# EAGLE design imu (EAGLE 9.5.2)
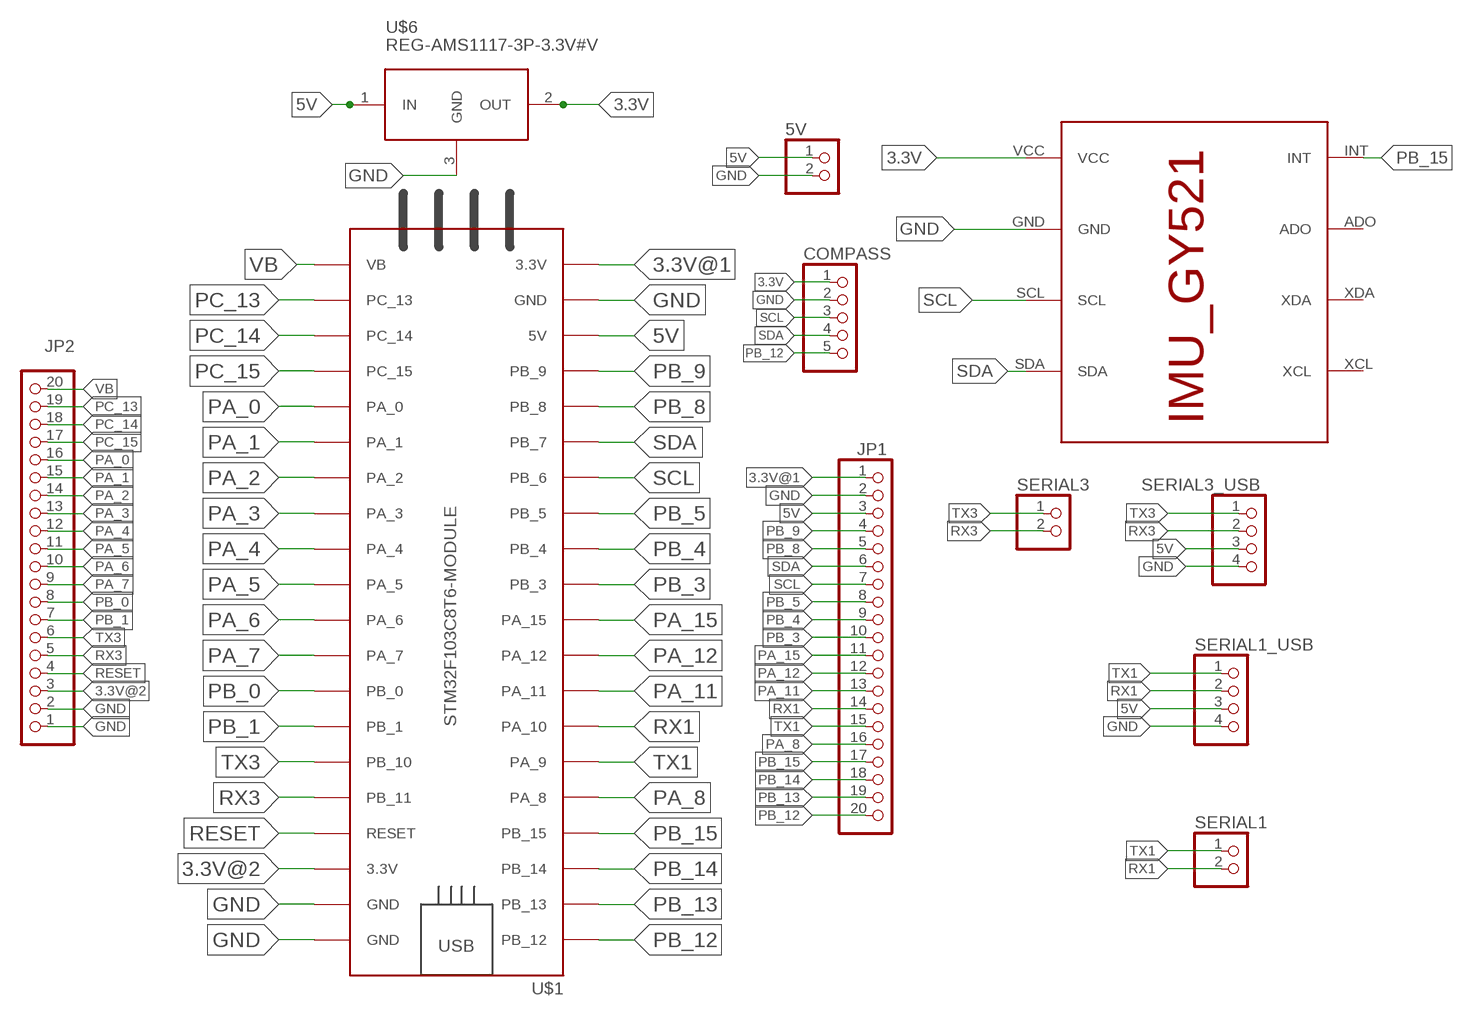
[diagram p0: schematic, sheet 1]

## Parts
5V  PINHD-2_DATA  [1X02_DATA]
COMPASS  PINHD-1X5  [1X05]
JP1  PINHD-1X20  [1X20]
JP2  PINHD-1X20  [1X20]
SERIAL1  PINHD-2_DATA  [1X02_DATA]
SERIAL1_USB  PINHD-4_DATA  [1X04_DATA]
SERIAL3  PINHD-2_DATA  [1X02_DATA]
SERIAL3_USB  PINHD-4_DATA  [1X04_DATA]
U$1  STM32F103C8T6-MODULE  [STM32F103C8T6-MODULE]
U$2  IMU_ROBOCON_GY521  [IMU_GY521]
U$6  REG-AMS1117-3P-3.3V#V  [REG-AMS1117-3P#V]

## Nets
3.3V: COMPASS.1 U$2.VCC U$6.2(OUT)
3.3V@1: JP1.1 U$1.3.3V_1(3.3V)
3.3V@2: JP2.3 U$1.3.3V_2(3.3V)
5V: 5V.1 JP1.3 SERIAL1_USB.3 SERIAL3_USB.3 U$1.5V U$6.1(IN)
GND: 5V.2 COMPASS.2 JP1.2 JP2.1 JP2.2 SERIAL1_USB.4 SERIAL3_USB.4 U$1.GND_1(GND) U$1.GND_2(GND) U$1.GND_3(GND) U$2.GND U$6.3(GND)
PA_0: JP2.16 U$1.PA_0
PA_1: JP2.15 U$1.PA_1
PA_2: JP2.14 U$1.PA_2
PA_3: JP2.13 U$1.PA_3
PA_4: JP2.12 U$1.PA_4
PA_5: JP2.11 U$1.PA_5
PA_6: JP2.10 U$1.PA_6
PA_7: JP2.9 U$1.PA_7
PA_8: JP1.16 U$1.PA_8
PA_11: JP1.13 U$1.PA_11
PA_12: JP1.12 U$1.PA_12
PA_15: JP1.11 U$1.PA_15
PB_0: JP2.8 U$1.PB_0
PB_1: JP2.7 U$1.PB_1
PB_3: JP1.10 U$1.PB_3
PB_4: JP1.9 U$1.PB_4
PB_5: JP1.8 U$1.PB_5
PB_8: JP1.5 U$1.PB_8
PB_9: JP1.4 U$1.PB_9
PB_12: COMPASS.5 JP1.20 U$1.PB_12
PB_13: JP1.19 U$1.PB_13
PB_14: JP1.18 U$1.PB_14
PB_15: JP1.17 U$1.PB_15 U$2.INT
PC_13: JP2.19 U$1.PC_13
PC_14: JP2.18 U$1.PC_14
PC_15: JP2.17 U$1.PC_15
RESET: JP2.4 U$1.RESET
RX1: JP1.14 SERIAL1.2 SERIAL1_USB.2 U$1.PA_10
RX3: JP2.5 SERIAL3.2 SERIAL3_USB.2 U$1.PB_11
SCL: COMPASS.3 JP1.7 U$1.PB_6 U$2.SCL
SDA: COMPASS.4 JP1.6 U$1.PB_7 U$2.SDA
TX1: JP1.15 SERIAL1.1 SERIAL1_USB.1 U$1.PA_9
TX3: JP2.6 SERIAL3.1 SERIAL3_USB.1 U$1.PB_10
VB: JP2.20 U$1.VB
Unconnected: U$2.ADO U$2.XCL U$2.XDA

## Library data of the parts
5V SERIAL1 SERIAL3 = MIA_LIBRARY-2-2-2:PINHD-2_DATA: PIN HEADER
COMPASS = MIA_LIBRARY-2-2-2:PINHD-1X5: PIN HEADER
JP1 JP2 = MIA_LIBRARY-2-2-2:PINHD-1X20: PIN HEADER
SERIAL1_USB SERIAL3_USB = MIA_LIBRARY-2-2-2:PINHD-4_DATA: PIN HEADER
U$1 = MIA_LIBRARY-2-2-2:STM32F103C8T6-MODULE: STM32F103C8T6 module with ARM Cortex-3, 20kB SRAM, 64kB Flash, 72MHz
U$2 = MIA_LIBRARY-2-2-2:IMU_ROBOCON_GY521
U$6 = MIA_LIBRARY-2-2-2:REG-AMS1117-3P-*: Linear Regulator based on AMS1117 chip 3-pin version AMS1117 datasheet is available here: http://www.advanced-monolithic.com/pdf/ds1117.pdf Click here to find device on ebay.com <http://www.ebay.com/sch/ams1117+module> Note: There are many variants. Search for the proper version.

## Board
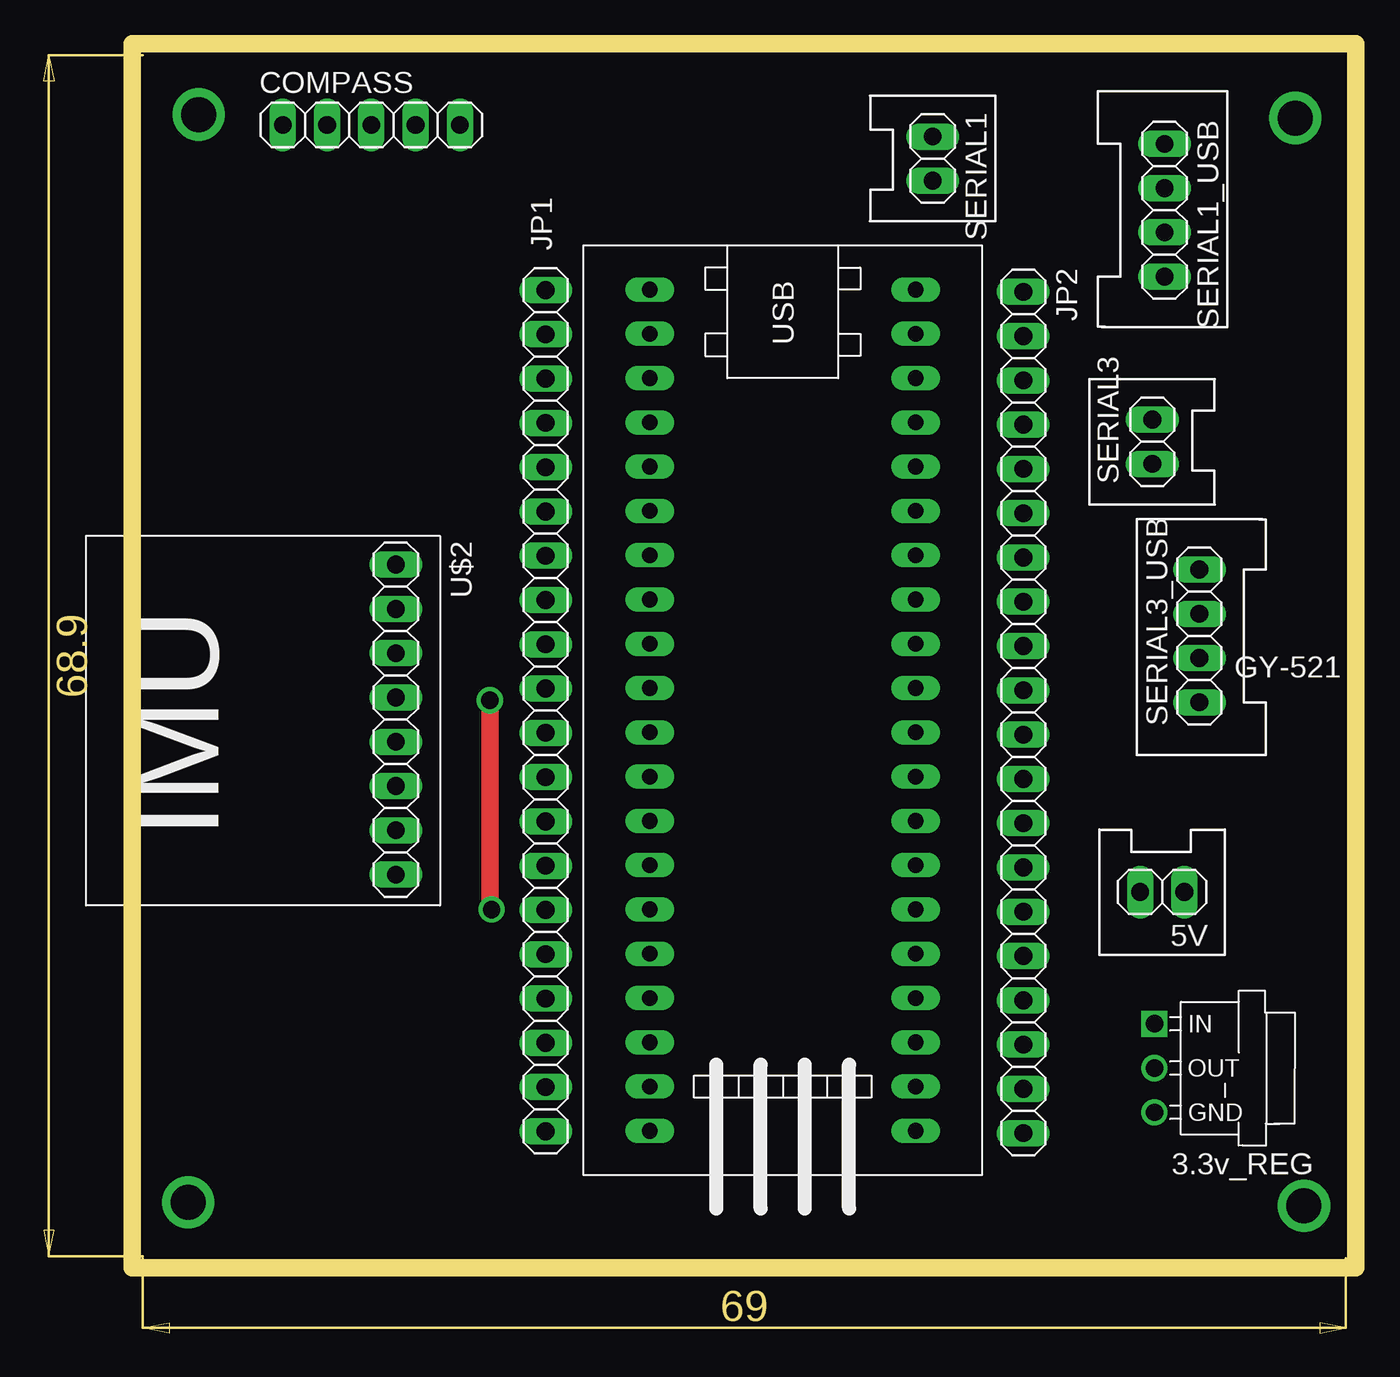
[diagram p1: board, top side]
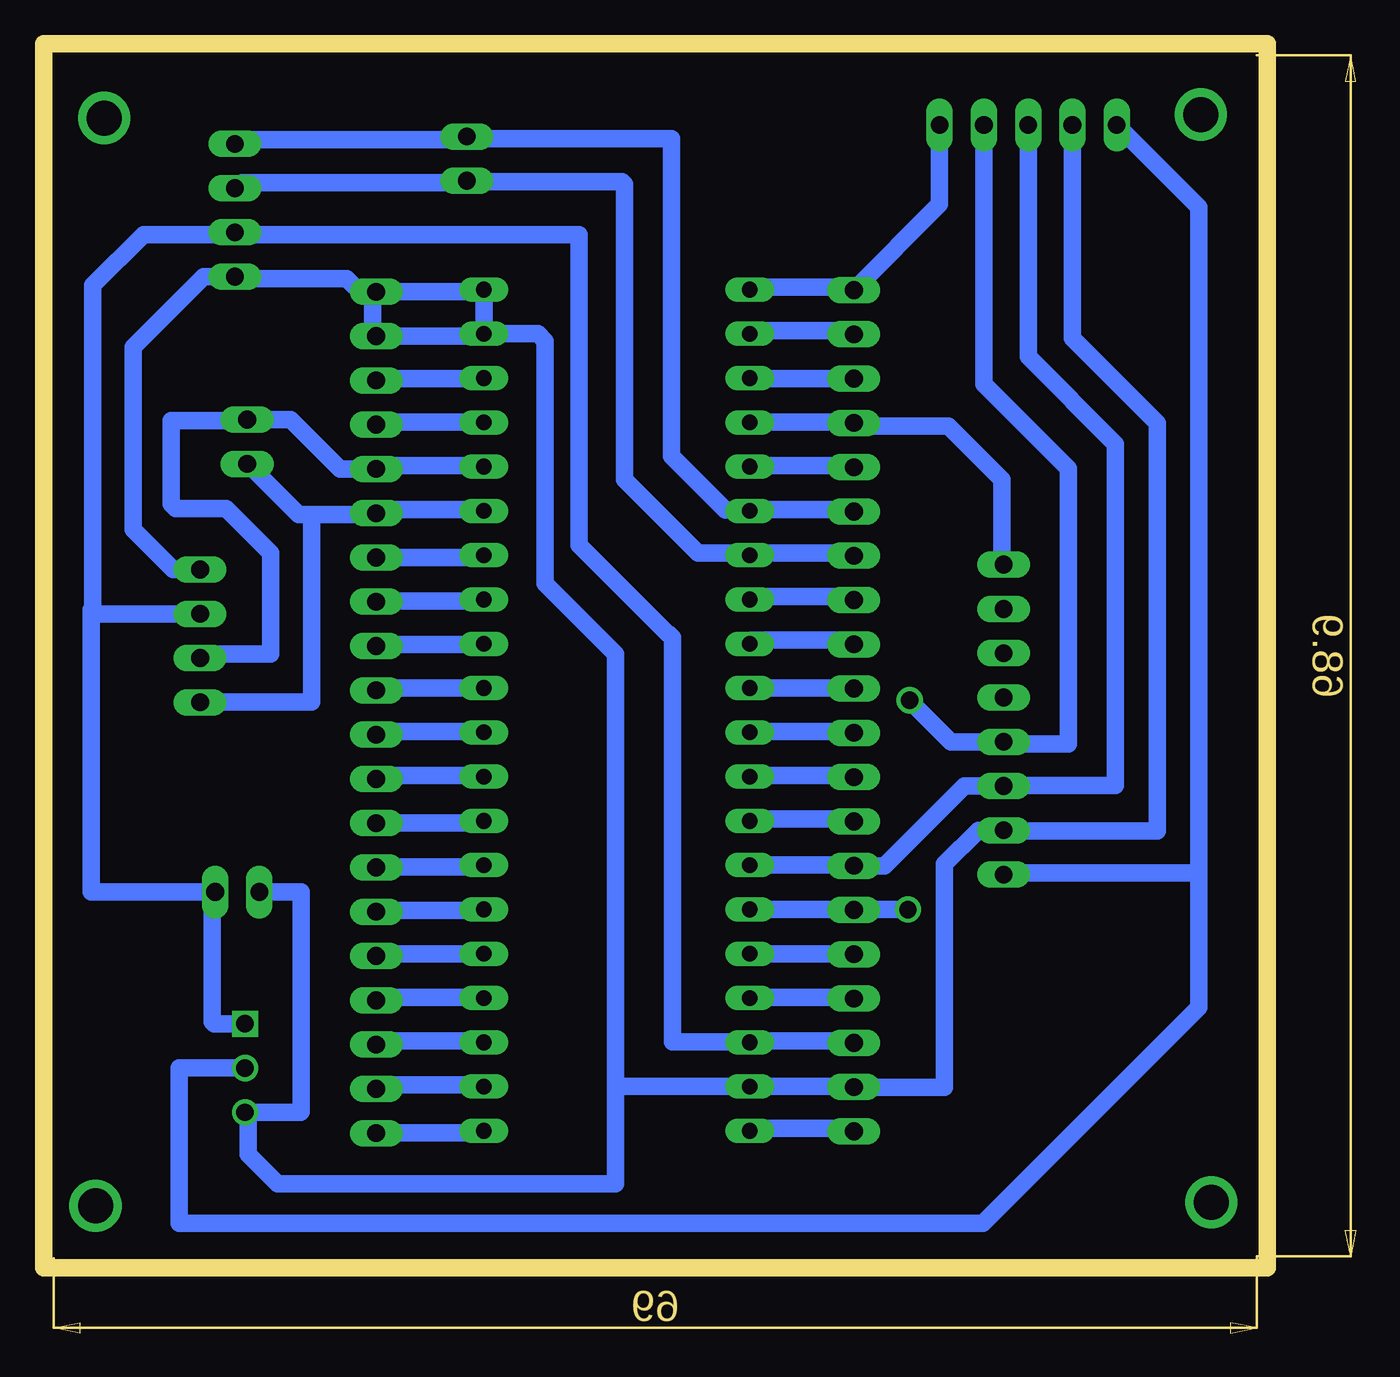
[diagram p2: board, bottom side, seen from below]

Size 70.2 x 70.21 mm. Coordinates in mm from the lower left corner, seen from the top.
Outline: 0.01,0 70.2,0 70.2,70.21 0,70.21 0.01,0
Copper layers (1*16): Top 0.035mm / dielectric 1.5mm / Bottom 0.035mm
Design rules "default *": minimum track width 1mm, minimum drill 0.35mm, track to track 0.8mm, track to pad 0.8mm, pad to pad 0.8mm, via to via 0.8mm, smd to smd 6mil, copper to edge 0.8mm, drill to drill 0.8mm, minimum pad ring 10mil, minimum via ring 8mil, stop-mask expansion 4mil, vias tented up to drill 0mil, thermal gap 10mil

### Footprints (pad centres in the part's own frame; a part is rotated, then mirrored left to right if it is on the bottom)
1X02_DATA = drill 1.016 long: 1 -1.27,0; 2 1.27,0
1X05 = drill 1.016 long: 1 -5.08,0; 2 -2.54,0; 3 0,0; 4 2.54,0; 5 5.08,0
1X20 = drill 1.016 long: 1 -24.13,0; 2 -21.59,0; 3 -19.05,0; 4 -16.51,0; 5 -13.97,0; 6 -11.43,0; 7 -8.89,0; 8 -6.35,0; 9 -3.81,0; 10 -1.27,0; 11 1.27,0; 12 3.81,0; 13 6.35,0; 14 8.89,0; 15 11.43,0; 16 13.97,0; 17 16.51,0; 18 19.05,0; 19 21.59,0; 20 24.13,0
1X04_DATA = drill 1.016 long: 1 -3.81,0; 2 -1.27,0; 3 1.27,0; 4 3.81,0
STM32F103C8T6-MODULE = drill 0.9 long: 3.3V_1 25.4,-7.62; 3.3V_2 -17.78,7.62; 5V 20.32,-7.62; GND_1 22.86,-7.62; GND_2 -20.32,7.62; GND_3 -22.86,7.62; PA_0 15.24,7.62; PA_1 12.7,7.62; PA_2 10.16,7.62; PA_3 7.62,7.62; PA_4 5.08,7.62; PA_5 2.54,7.62; PA_6 0,7.62; PA_7 -2.54,7.62; PA_8 -12.7,-7.62; PA_9 -10.16,-7.62; PA_10 -7.62,-7.62; PA_11 -5.08,-7.62; PA_12 -2.54,-7.62; PA_15 0,-7.62; PB_0 -5.08,7.62; PB_1 -7.62,7.62; PB_3 2.54,-7.62; PB_4 5.08,-7.62; PB_5 7.62,-7.62; PB_6 10.16,-7.62; PB_7 12.7,-7.62; PB_8 15.24,-7.62; PB_9 17.78,-7.62; PB_10 -10.16,7.62; PB_11 -12.7,7.62; PB_12 -22.86,-7.62; PB_13 -20.32,-7.62; PB_14 -17.78,-7.62; PB_15 -15.24,-7.62; PC_13 22.86,7.62; PC_14 20.32,7.62; PC_15 17.78,7.62; RESET -15.24,7.62; VB 25.4,7.62
IMU_GY521 = drill 1.016 long: ADO -6.35,0; GND 6.35,0; INT -8.89,0; SCL 3.81,0; SDA 1.27,0; VCC 8.89,0; XCL -3.81,0; XDA -1.27,0
REG-AMS1117-3P#V = drill 1 square: 1 -2.54,-5.08 | drill 1: 2 0,-5.08; 3 2.54,-5.08

### Placement (x,y rotation side)
5V  59.09,21.54 180 top
COMPASS  13.72,65.54 0 top
JP1  23.72,31.94 90 top
JP2  51.12,31.84 270 top
SERIAL1  45.92,63.61 270 top
SERIAL1_USB  59.22,60.65 270 top
SERIAL3  58.52,47.37 90 top
SERIAL3_USB  61.22,36.23 90 top
U$1  37.32,33.24 270 top
U$2  15.12,31.43 270 top
U$6  63.72,11.44 270 top

### Tracks (layer width: path | path; a pad name or v marks a point on that pad's centre or on a via)
3.3V
  Bottom 1: 3.94,22.64 15.02,22.64 U$2.VCC | U$6.2 62.42,11.44 62.42,2.54 16.32,2.54 3.94,14.92 3.94,22.64 | COMPASS.1 3.94,60.84 3.94,22.64
3.3V@1
  Bottom 1: U$1.3.3V_1 29.57,7.99 23.82,7.99 JP1.1
3.3V@2
  Bottom 1: U$1.3.3V_2 45.07,50.99 51.07,50.99 JP2.3
5V
  Bottom 1: JP1.3 23.82,12.99 29.57,12.99 U$1.5V 29.72,12.94 34.12,12.94 34.12,36.14 34.32,36.34 34.37,36.34 39.47,41.44 39.47,59.24 58.82,59.24 SERIAL1_USB.3 59.32,59.24 64.47,59.24 67.37,56.34 67.37,37.84 67.47,37.74 | U$6.1 60.41,13.98 60.52,14.09 60.52,21.38 5V.1 67.47,21.54 67.47,37.74 | 67.47,37.74 67.23,37.5 SERIAL3_USB.3
GND
  Bottom 1: JP2.1 51.32,55.74 51.32,53.49 JP2.2 45.07,53.43 U$1.GND_2 | JP2.1 51.82,55.74 52.82,56.74 59.07,56.74 SERIAL1_USB.4 61.02,56.84 65.07,52.79 65.07,42.34 62.77,40.04 SERIAL3_USB.4 | 5V.2 55.42,21.54 55.42,8.94 55.46,8.9 U$6.3 58.47,8.69 58.47,6.49 56.77,4.79 37.38,4.79 37.38,10.18 | 37.38,10.18 37.18,10.38 U$1.GND_1 23.75,10.38 JP1.2 18.52,10.34 18.52,23.14 16.58,25.08 U$2.GND 15.08,25.04 6.32,25.04 6.32,48.44 11.18,53.3 COMPASS.2 | U$1.GND_2 41.84,53.56 41.42,53.14 41.42,39.24 37.38,35.2 37.38,10.18 | U$1.GND_2 U$1.GND_3 45.07,55.97 JP2.1
N$1  (via drill 2 pad 3)
  other vias: 3.82,66.14
N$2  (via drill 2 pad 3)
  other vias: 66.72,65.94
N$3  (via drill 2 pad 3)
  other vias: 67.22,3.54
N$4  (via drill 2 pad 3)
  other vias: 3.22,3.74
PA_0
  Bottom 1: U$1.PA_0 45.07,17.99 51.07,17.99 JP2.16
PA_1
  Bottom 1: U$1.PA_1 45.07,20.49 51.07,20.49 JP2.15
PA_2
  Bottom 1: U$1.PA_2 45.07,22.99 51.07,22.99 JP2.14
PA_3
  Bottom 1: JP2.13 45.07,25.49 U$1.PA_3
PA_4
  Bottom 1: U$1.PA_4 45.07,28.24 51.07,28.24 JP2.12
PA_5
  Bottom 1: U$1.PA_5 45.07,30.74 51.07,30.74 JP2.11
PA_6
  Bottom 1: U$1.PA_6 51.07,33.24 JP2.10
PA_7
  Bottom 1: U$1.PA_7 45.07,35.74 51.07,35.74 JP2.9
PA_8
  Bottom 1: U$1.PA_8 29.57,45.99 23.82,45.99 JP1.16
PA_11
  Bottom 1: U$1.PA_11 29.57,38.49 23.82,38.49 JP1.13
PA_12
  Bottom 1: U$1.PA_12 29.57,35.99 23.82,35.99 JP1.12
PA_15
  Bottom 1: JP1.11 23.82,33.24 U$1.PA_15
PB_0
  Bottom 1: U$1.PB_0 45.07,38.24 51.07,38.24 JP2.8
PB_1
  Bottom 1: U$1.PB_1 45.07,40.74 51.07,40.74 JP2.7
PB_3
  Bottom 1: U$1.PB_3 29.57,30.74 23.82,30.74 JP1.10
PB_4
  Bottom 1: U$1.PB_4 29.57,28.24 23.82,28.24 JP1.9
PB_5
  Bottom 1: U$1.PB_5 29.57,25.74 23.82,25.74 JP1.8
PB_8
  Bottom 1: U$1.PB_8 29.57,17.99 23.82,17.99 JP1.5
PB_9
  Bottom 1: U$1.PB_9 29.57,15.49 23.82,15.49 JP1.4
PB_12
  Bottom 1: U$1.PB_12 29.57,56.24 23.82,56.24 JP1.20 18.8,60.99 COMPASS.5
PB_13
  Bottom 1: U$1.PB_13 29.57,53.74 23.82,53.74 JP1.19
PB_14
  Bottom 1: JP1.18 29.57,50.99 U$1.PB_14
PB_15
  Bottom 1: U$1.PB_15 29.57,48.49 23.82,48.49 JP1.17 23.54,48.27 18.3,48.27 15.22,45.19 15.22,40.42 U$2.INT
PC_13
  Bottom 1: U$1.PC_13 45.07,10.49 51.07,10.49 JP2.19
PC_14
  Bottom 1: U$1.PC_14 45.07,12.99 51.07,12.99 JP2.18
PC_15
  Bottom 1: U$1.PC_15 45.07,15.49 51.07,15.49 JP2.17
RESET
  Bottom 1: U$1.RESET 45.07,48.49 51.07,48.49 JP2.4
RX1
  Bottom 1: JP1.14 23.82,40.99 29.57,40.99 U$1.PA_10 30.07,40.99 32.67,40.99 36.87,45.19 36.87,62.14 37.02,62.29 45.87,62.29 SERIAL1.2 46.07,62.24 58.82,62.24 59.07,61.99 SERIAL1_USB.2
RX3
  Bottom 1: U$1.PB_11 45.07,45.99 51.07,45.99 JP2.5 53.19,45.81 56.02,48.64 SERIAL3.2 58.57,48.59 62.87,48.59 62.87,43.79 62.62,43.54 59.72,43.54 57.17,40.99 57.17,35.19 60.84,35.19 SERIAL3_USB.2
SCL
  Bottom 1: COMPASS.3 13.72,52.24 8.72,47.24 8.72,27.64 15.1,27.64 U$2.SCL 17.39,27.62 21.96,23.05 JP1.7 23.75,23.08 U$1.PB_6
SDA  (via drill 1 pad 1)
  Top 1: v20.52,32.54 20.52,20.64 v20.62,20.54
  Bottom 1: 23.73,20.54 U$1.PB_7 | 23.73,20.54 JP1.6 | COMPASS.4 16.26,50.68 11.42,45.84 11.42,30.04 15,30.04 U$2.SDA 18.14,30.16 v20.52,32.54 | v20.62,20.54 23.73,20.54
TX1
  Bottom 1: JP1.15 23.82,43.49 29.57,43.49 U$1.PA_9 29.74,43.44 31.07,43.44 34.17,46.54 34.17,64.74 45.57,64.74 SERIAL1.1 46.07,64.74 46.12,64.69 58.07,64.69 SERIAL1_USB.1
TX3
  Bottom 1: U$1.PB_10 45.07,43.49 51.07,43.49 JP2.6 51.2,43.19 54.82,43.19 | 54.82,43.19 55.57,43.19 58.49,46.11 SERIAL3.1 | 54.82,43.19 54.82,32.44 61.2,32.44 SERIAL3_USB.1
VB
  Bottom 1: U$1.VB 45.07,7.74 51.07,7.74 JP2.20

### Text on the board
tPlace: GY-521 | 3.3v_REG